# EAGLE design dissolutionShield (EAGLE 7.1.0)
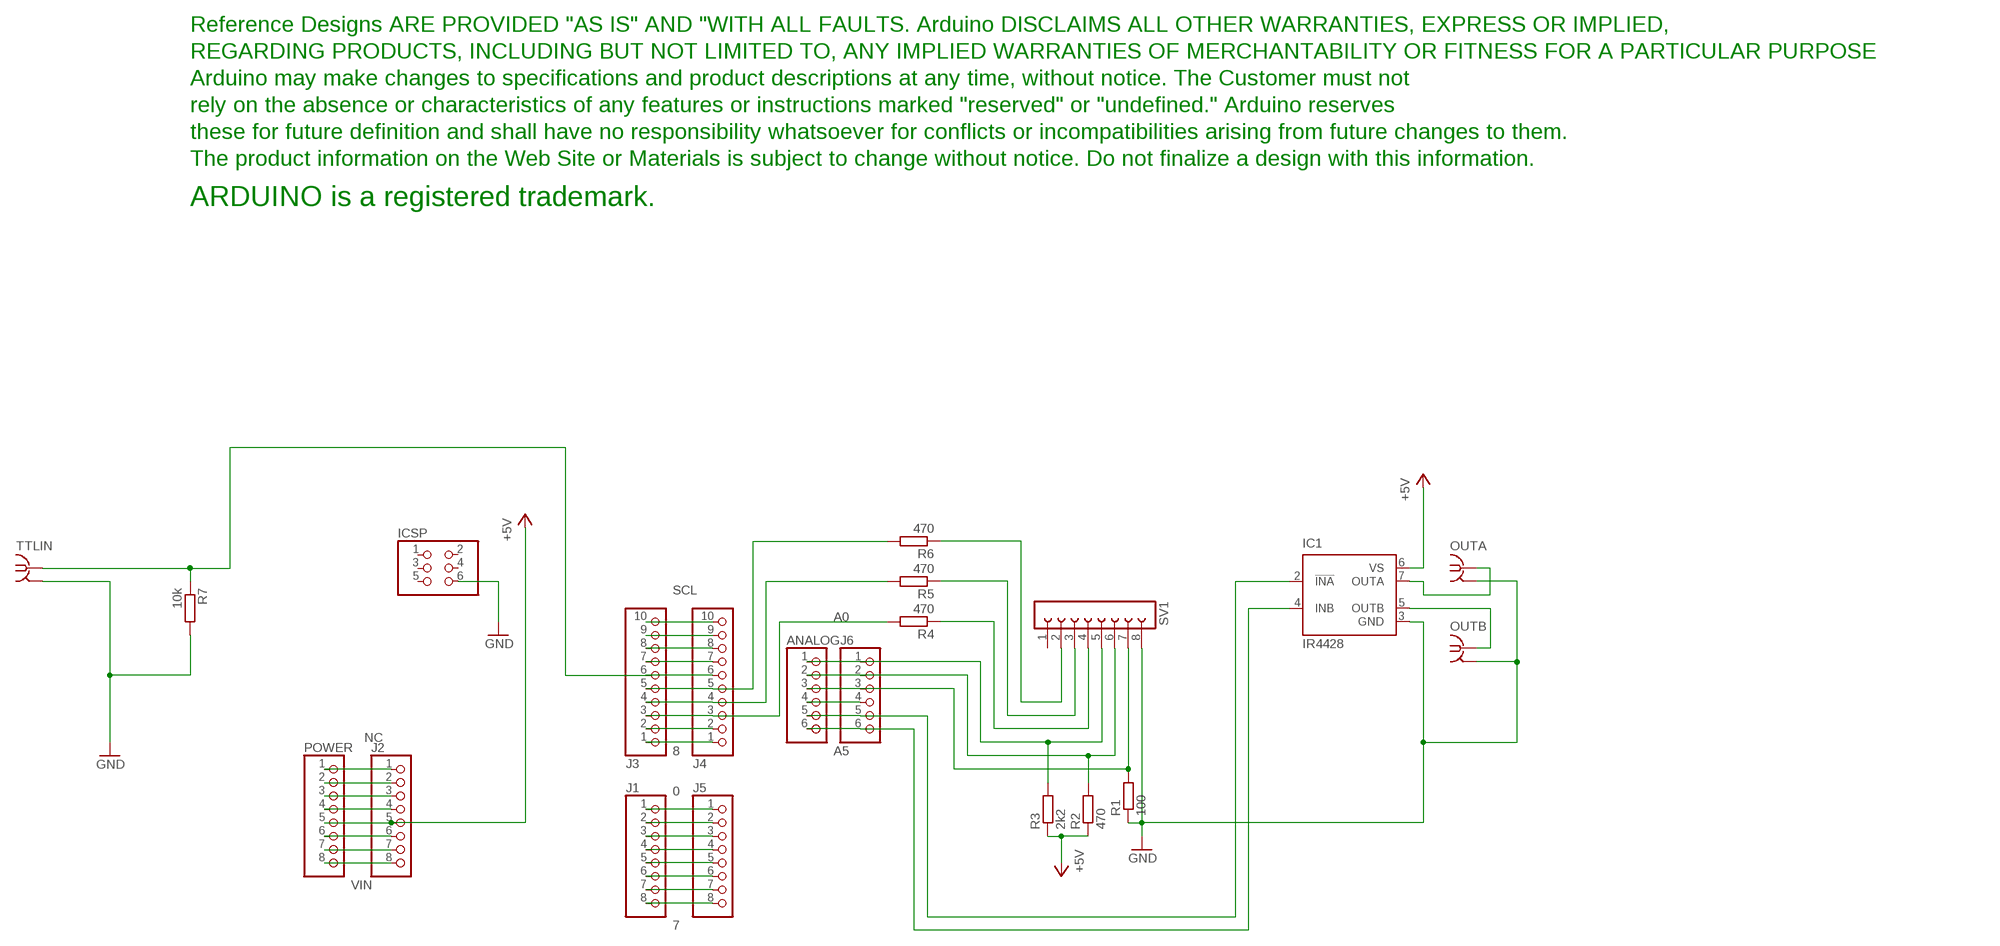
[diagram p0: schematic, sheet 1]

## Parts
ANALOG  PINHD-1X6  [1X06]
IC1  IR4428  [DIL08]
ICSP  PINHD-2X3  [2X03]
J1  PINHD-1X8TH  [1X08-TH]
J2  PINHD-1X8TH  [1X08-TH]
J3  PINHD-1X10TH  [1X10-TH]
J4  PINHD-1X10TH  [1X10-TH]
J5  PINHD-1X8TH  [1X08-TH]
J6  PINHD-1X6  [1X06]
OUTA  BU-SMA-H  [BU-SMA-H]
OUTB  BU-SMA-H  [BU-SMA-H]
POWER  PINHD-1X8TH  [1X08-TH]
R1  100  R-EU_0207/10  [0207/10]
R2  470  R-EU_0207/10  [0207/10]
R3  2k2  R-EU_0207/10  [0207/10]
R4  470  R-EU_0207/10  [0207/10]
R5  470  R-EU_0207/10  [0207/10]
R6  470  R-EU_0207/10  [0207/10]
R7  10k  R-EU_0207/10  [0207/10]
SV1  FE08-1  [FE08]
TTLIN  BU-SMA-H  [BU-SMA-H]
U$1  DISCLAIMER  [DISCLAIMER]

## Nets
0: J1.1 J5.1
1: J1.2 J5.2
2: J1.3 J5.3
3: J1.4 J5.4
4: J1.5 J5.5
5: J1.6 J5.6
6: J1.7 J5.7
7: J1.8 J5.8
8: J3.1 J4.1
9: J3.2 J4.2
10: J3.3 J4.3 R4.2
11: J3.4 J4.4 R5.2
+3V3: J2.4 POWER.4
+5V: IC1.6(VS) J2.5 POWER.5 R2.1 R3.1
A0: ANALOG.1 J6.1 R3.2 SV1.5
A1: ANALOG.2 J6.2 R2.2 SV1.6
A2: ANALOG.3 J6.3 R1.2 SV1.7
A3: ANALOG.4 J6.4
A4: ANALOG.5 IC1.2(!INA) J6.5
A5: ANALOG.6 IC1.4(INB) J6.6
AREF: J3.8 J4.8
GND: IC1.3(GND) ICSP.6 J2.6 J2.7 J3.7 J4.7 OUTA.2 OUTA.3 OUTA.4 OUTA.5 OUTB.2 OUTB.3 OUTB.4 OUTB.5 POWER.6 POWER.7 R1.1 R7.2 SV1.8 TTLIN.2 TTLIN.3 TTLIN.4 TTLIN.5
IOREF: J2.2 POWER.2
N12: J3.5 J4.5 R6.2
N13: J3.6 J4.6 R7.1 TTLIN.1
N$2: IC1.7(OUTA) OUTA.1
N$3: IC1.5(OUTB) OUTB.1
N$4: R4.1 SV1.4
N$5: R5.1 SV1.3
N$6: R6.1 SV1.2
NC: J2.1 POWER.1
RESET: J2.3 POWER.3
SCL: J3.10 J4.10
SDA: J3.9 J4.9
VIN: J2.8 POWER.8
Unconnected: ICSP.1 ICSP.2 ICSP.3 ICSP.4 ICSP.5 SV1.1

## Library data of the parts
ANALOG J6 = pinhead:PINHD-1X6: PIN HEADER
IC1 = ir:IR4428: DUAL LOW SIDE DRIVER Source: ID4426.pdf; MF: INTERNATIONAL RECTIFIER(IR); MPN: IR4428PBF; OC_FARNELL: 1023268; OC_NEWARK: 19K8464
ICSP = SmartPrj:PINHD-2X3: PIN HEADER
J1 J2 J5 POWER = SmartPrj:PINHD-1X8: PIN HEADER
J3 J4 = SmartPrj:PINHD-1X10: PIN HEADER
OUTA OUTB TTLIN = con-coax:BU-SMA-H: FEMALE SMA CONNECTOR Radiall; OC_FARNELL: unknown; OC_NEWARK: unknown
R1-R7 = rcl:R-EU_: RESISTOR, European symbol
SV1 = con-lsta:FE08-1: FEMALE HEADER; OC_FARNELL: unknown; OC_NEWARK: unknown
U$1 = SmartPrj:DISCLAIMER

## Board
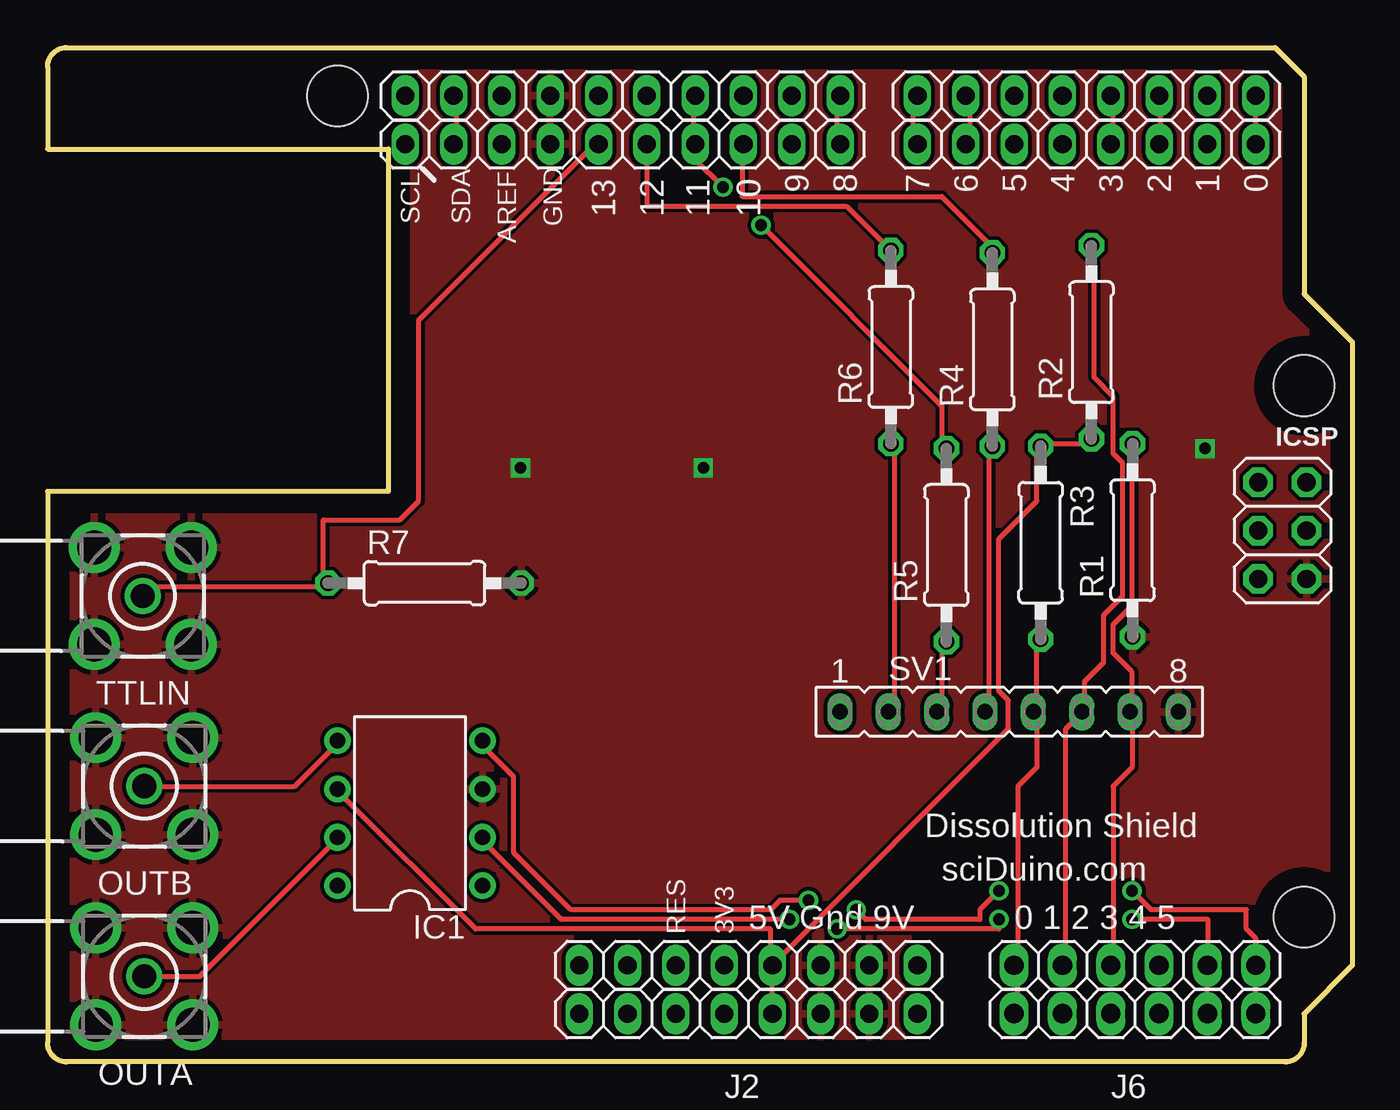
[diagram p1: board, top side]
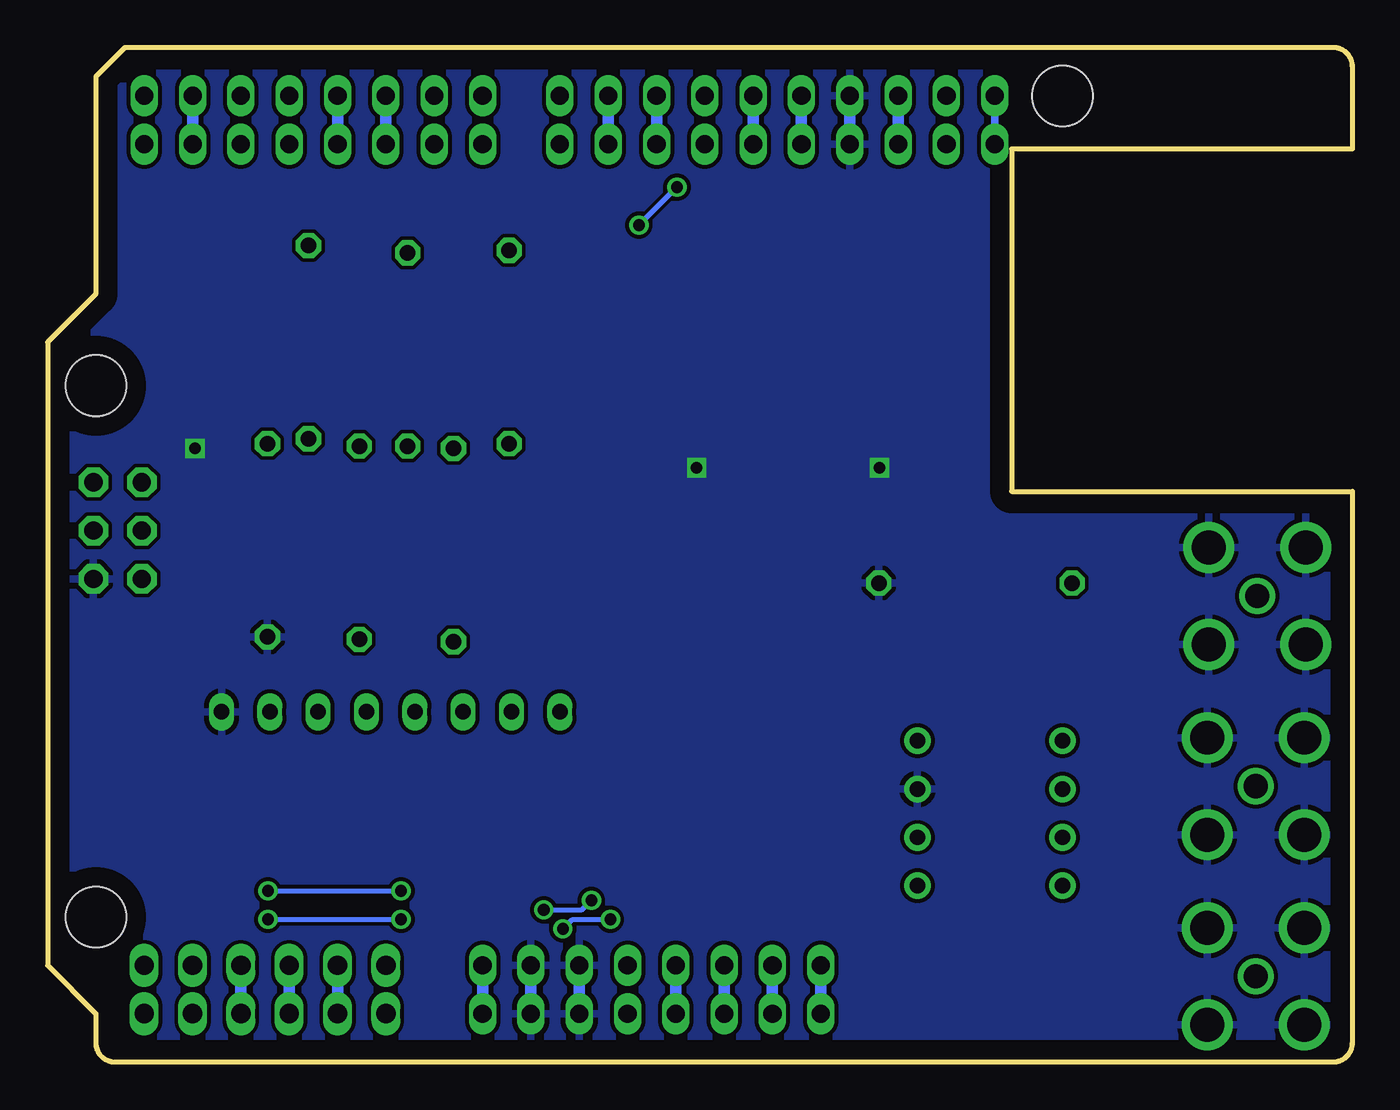
[diagram p2: board, bottom side, seen from below]

Size 68.58 x 53.34 mm. Coordinates in mm from the lower left corner, seen from the top.
Outline: 66.04,1 arc-90 65.04,0
Outline: 1,0 arc-90 0,1
Outline: 0,52.34 arc-90 1,53.34
Outline: 66.04,1 arc-90 65.04,0
Outline: 1,0 arc-90 0,1
Outline: 0,52.34 arc-90 1,53.34
Outline: 66.04,1 arc-90 65.04,0
Outline: 1,0 arc-90 0,1
Outline: 0,52.34 arc-90 1,53.34
Outline: 66.04,1 66.04,2.54 68.58,5.08 68.58,37.85 66.04,40.39 66.04,51.82 64.52,53.34 1,53.34
Outline: 66.04,1 arc-90 65.04,0
Outline: 65.04,0 1,0
Outline: 1,0 arc-90 0,1
Outline: 0,52.34 arc-90 1,53.34
Outline: 0,52.32 0,48 17.91,48 17.91,30 0,30 0,1.02
Copper layers (1*16): Top 0.035mm / dielectric 1.5mm / Bottom 0.035mm
Design rules "default": minimum track width 10mil, minimum drill 24mil, track to track 8mil, track to pad 8mil, pad to pad 8mil, via to via 8mil, smd to smd 8mil, copper to edge 40mil, drill to drill 8mil, minimum pad ring 10mil, minimum via ring 8mil, stop-mask expansion 2mil, vias tented up to drill 0mil, thermal gap 10mil
Holes 3.2 mm at 15.24,50.8 66.04,7.62 66.04,35.56

### Footprints (pad centres in the part's own frame; a part is rotated, then mirrored left to right if it is on the bottom)
1X06 = drill 1.016 long: 1 -6.35,0; 2 -3.81,0; 3 -1.27,0; 4 1.27,0; 5 3.81,0; 6 6.35,0
DIL08 = drill 0.8 pad 1.4: 1 -3.81,-3.81; 2 -1.27,-3.81; 3 1.27,-3.81; 4 3.81,-3.81; 5 3.81,3.81; 6 1.27,3.81; 7 -1.27,3.81; 8 -3.81,3.81
2X03 = drill 0.95 pad 1.55 octagon: 1 -2.54,-1.27; 2 -2.54,1.27; 3 0,-1.27; 4 0,1.27; 5 2.54,-1.27; 6 2.54,1.27
1X08-TH = drill 0.95 pad 1.422 long: 1 -8.89,0; 2 -6.35,0; 3 -3.81,0; 4 -1.27,0; 5 1.27,0; 6 3.81,0; 7 6.35,0; 8 8.89,0
1X10-TH = drill 0.95 pad 1.422 long: 1 -11.43,0; 2 -8.89,0; 3 -6.35,0; 4 -3.81,0; 5 -1.27,0; 6 1.27,0; 7 3.81,0; 8 6.35,0; 9 8.89,0; 10 11.43,0
BU-SMA-H = drill 1.27: 1 0,0 | drill 1.778: 2 -2.55,2.55; 3 2.55,2.55; 4 2.55,-2.55; 5 -2.55,-2.55
0207/10 = drill 0.813 octagon: 1 -5.08,0; 2 5.08,0
FE08 = drill 0.813 long: 1 -8.89,0; 2 -6.35,0; 3 -3.81,0; 4 -1.27,0; 5 1.27,0; 6 3.81,0; 7 6.35,0; 8 8.89,0

### Placement (x,y rotation side)
ANALOG  57.15,2.54 0 top
IC1  19.05,13.08 90 top
ICSP  64.9,27.94 270 top
J1  54.61,50.8 180 top
J2  36.83,2.54 0 top
J3  30.23,50.8 180 top
J4  30.23,48.26 180 top
J5  54.61,48.26 180 top
J6  57.15,5.08 0 top
OUTA  5.08,4.5 180 top
OUTB  5.08,14.5 180 top
POWER  36.83,5.08 0 top
R1  57.02,27.43 90 top
R2  54.86,37.85 90 top
R3  52.2,27.3 270 top
R4  49.66,37.47 90 top
R5  47.24,27.18 90 top
R6  44.32,37.59 90 top
R7  19.81,25.18 0 top
SV1  50.55,18.41 0 top
TTLIN  5,24.5 180 top
U$1  -5.97,-23.11 0 top  (outside the outline)

### Tracks (layer width: path | path; a pad name or v marks a point on that pad's centre or on a via)
0
  Top 0.254: J5.1 J1.1
1
  Bottom 0.61: J5.2 J1.2
2
  Top 0.254: J1.3 58.5,50.5 58.5,48.5 J5.3
3
  Top 0.254: J1.4 56,50.5 56,48.5 J5.4
4
  Bottom 0.61: J5.5 J1.5
5
  Bottom 0.61: J5.6 J1.6
6
  Top 0.254: J1.7 48.5,50.5 48.5,48.5 J5.7
7
  Top 0.254: J1.8 45.5,50.5 45.5,48.5 J5.8
8
  Top 0.254: J3.1 41.5,50.5 41.5,48.5 J4.1
9
  Bottom 0.61: J4.2 J3.2
10
  Top 0.254: R4.2 49.5,43 47,45.5 36.5,45.5 36.5,48 J4.3
  Bottom 0.61: J4.3 J3.3
11  (via drill 0.61)
  Top 0.254: J3.4 33.97,50.8 33.97,48.26 J4.4 34,48 34,47.5 v35.5,46 | v37.5,44 47,34.5 47,32.5 R5.2
  Bottom 0.254: v35.5,46 v37.5,44
+3V3
  Bottom 0.61: J2.4 POWER.4
+5V
  Top 0.254: J2.5 POWER.5 | R2.1 54.5,32.5 52.5,32.5 R3.1 52,32 52,29.5 50,27.5 50,19.5 50.5,19 50.5,17.5 38.5,5.5 POWER.5 | IC1.6 15.5,14 22.5,7 38,7 38,5.5 POWER.5
A0
  Top 0.254: ANALOG.1 51,3 51,5 J6.1 51,5.5 51,14.5 52,15.5 52,18 SV1.5 52,18.5 52,22 R3.2
A1
  Top 0.254: J6.2 53.5,5.5 53.5,17.5 54,18 SV1.6 54.5,18.5 54.5,20 55.5,21 55.5,23.5 56.5,24.5 56.5,31.5 56,32 56,35 55,36 55,42.5 R2.2
  Bottom 0.61: ANALOG.2 J6.2
A2
  Top 0.254: R1.2 57,32.5 57,24 56,23 56,21.5 57,20.5 57,18.5 SV1.7 57,18 57,15.5 56,14.5 56,5.5 J6.3
  Bottom 0.61: ANALOG.3 J6.3
A3
  Bottom 0.61: ANALOG.4 J6.4
A4  (via drill 0.61)
  Top 0.254: ANALOG.5 J6.5 61,5.5 61,7.5 v57,7.5 | v39,7.5 27,7.5 23,11.5 IC1.2 | v41.5,7 50,7 v50,7.5
  Bottom 0.254: v39,7.5 41,7.5 v41.5,7 | v57,7.5 v50,7.5
A5  (via drill 0.61)
  Top 0.254: ANALOG.6 J6.6 63.5,6.5 63,7 63,8 58,8 v57,9 | v40,8.5 38.5,8.5 38,8 27.5,8 24.5,11 24.5,15 23,16.5 IC1.4 | v42.5,8 43,7.5 49,7.5 49,8 v50,9
  Bottom 0.254: v40,8.5 40.5,8 v42.5,8 | v57,9 v50,9
AREF
  Bottom 0.61: J4.8 J3.8
GND  (via drill 0.6)
  Bottom 0.61: POWER.7 J2.7 | J2.6 POWER.6 | J4.7 J3.7
  other vias: 34.46,31.24 24.86,31.24 60.83,32.26
  pour Bottom: 69.22,53.59 69.22,-0.38 -0.13,-0.38 -0.13,53.72
  pour Top: -0.38,53.72 69.22,53.72 69.22,-0.89 -0.38,-0.89
IOREF
  Bottom 0.61: J2.2 POWER.2
N12
  Top 0.254: R6.2 44,43 42,45 31.5,45 31.5,48 J4.5
  Bottom 0.61: J4.5 J3.5
N13
  Top 0.254: TTLIN.1 5,25 14.5,25 R7.1 14.5,25.5 14.5,28.5 18.5,28.5 19.5,29.5 19.5,39 28.5,48 J4.6
  Bottom 0.61: J4.6 J3.6
N$2
  Top 0.254: OUTA.1 8,4.5 15,11.5 IC1.7
N$3
  Top 0.254: OUTB.1 13,14.5 15,16.5 IC1.5
N$4
  Top 0.254: R4.1 49.5,32 49.5,18.5 SV1.4
N$5
  Top 0.254: SV1.3 47,18.5 47,22 R5.1
N$6
  Top 0.254: SV1.2 44.5,18.5 44.5,32.5 R6.1
NC
  Bottom 0.61: J2.1 POWER.1
RESET
  Bottom 0.61: POWER.3 J2.3
SCL
  Bottom 0.406: J4.10 J3.10
SDA
  Top 0.254: J3.9 21.5,50.5 21.5,48.5 J4.9
VIN
  Bottom 0.61: J2.8 POWER.8

### Text on the board
tPlace: 9 | 8 | 7 | 6 | 5 | 4 | 3 | 2 | 1 | 0 | 13 | 12 | 11 | 10 | 10 | Dissolution Shield | sciDuino.com
tNames: SCL | SDA | GND | AREF | RES | 3V3 | 5V Gnd 9V | 0 1 2 3 4 5
bStop: SDA | AREF | GND